# Altium schematic sheet SH6 - MICROCONTROLLER.SchDoc: Microcontroller
size B; CheckedBy: Lance Bantoto; DrawnBy: Kyle Hong; Engineer: Kyle Hong; Organization: UW Robotics; Address1: 200 University Avenue; Address2: Waterloo; Address3: Ontario; Address4: Canada N2L 3G6; Revision: 2; SheetNumber: 6; SheetTotal: 8
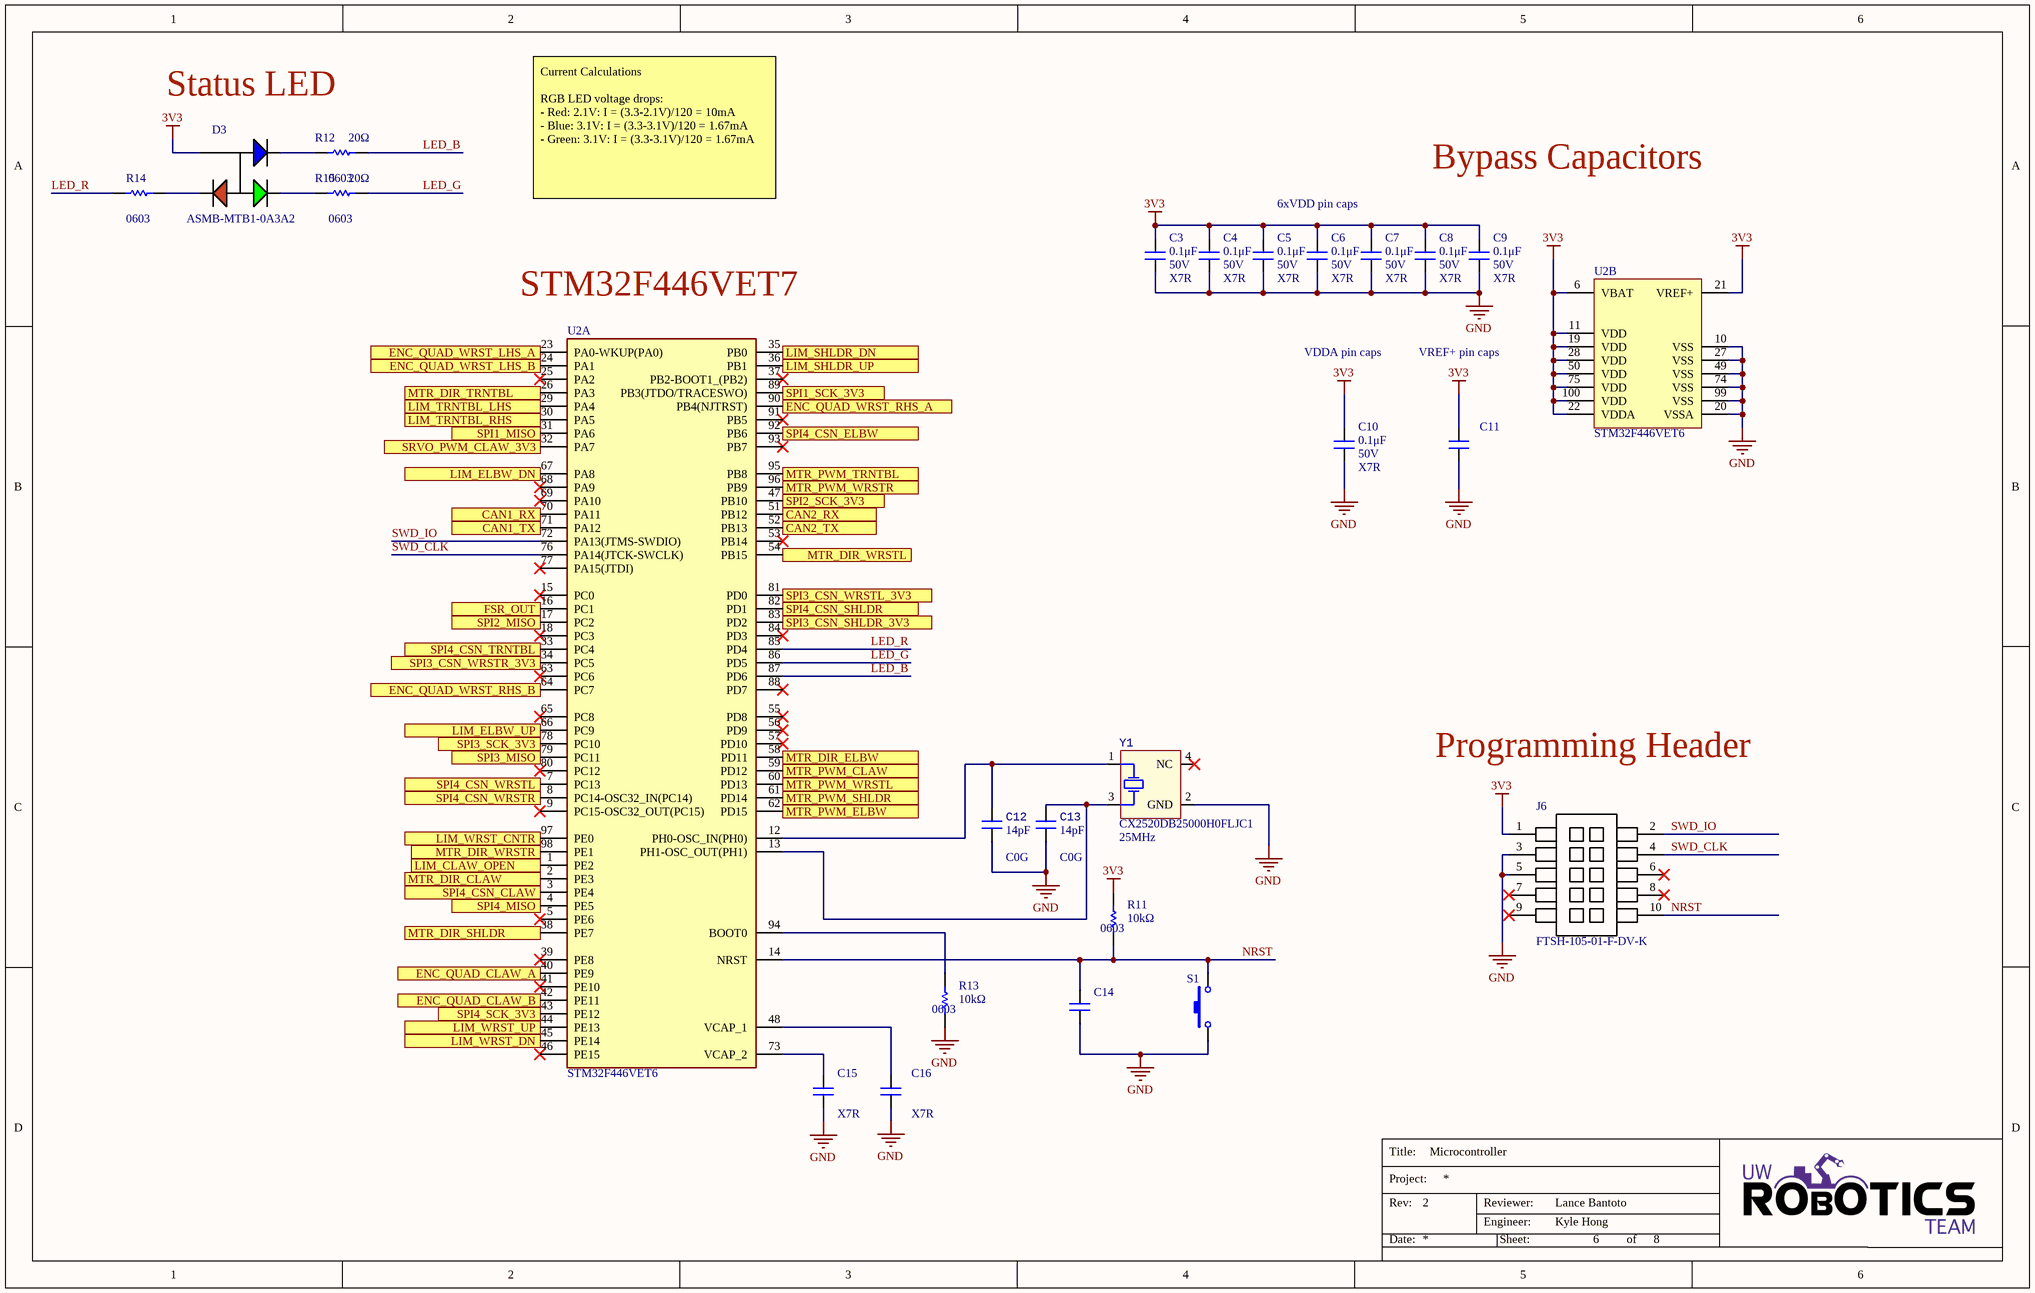
[diagram p0: SH6 - MICROCONTROLLER.SchDoc]

## Parts
C3  value 0.1μF  Voltage Rating: 50V  Dielectric: X7R  [CAP0603]  (hidden comment: CAP_0.1uF_50V_0603)
C4  value 0.1μF  Voltage Rating: 50V  Dielectric: X7R  [CAP0603]  (hidden comment: CAP_0.1uF_50V_0603)
C5  value 0.1μF  Voltage Rating: 50V  Dielectric: X7R  [CAP0603]  (hidden comment: CAP_0.1uF_50V_0603)
C6  value 0.1μF  Voltage Rating: 50V  Dielectric: X7R  [CAP0603]  (hidden comment: CAP_0.1uF_50V_0603)
C7  value 0.1μF  Voltage Rating: 50V  Dielectric: X7R  [CAP0603]  (hidden comment: CAP_0.1uF_50V_0603)
C8  value 0.1μF  Voltage Rating: 50V  Dielectric: X7R  [CAP0603]  (hidden comment: CAP_0.1uF_50V_0603)
C9  value 0.1μF  Voltage Rating: 50V  Dielectric: X7R  [CAP0603]  (hidden comment: CAP_0.1uF_50V_0603)
C10  value 0.1μF  Voltage Rating: 50V  Dielectric: X7R  [CAP0603]  (hidden comment: CAP_0.1uF_50V_0603)
C11  CAP_1uF_25V_0603  [CAP0603]  (value not drawn)
C12  value 14pF  Dielectric: C0G  [CAP0603]  (hidden comment: CAP_14pF_50V_0603)
C13  value 14pF  Dielectric: C0G  [CAP0603]  (hidden comment: CAP_14pF_50V_0603)
C14  CAP_1uF_25V_0603  [CAP0603]  (value not drawn)
C15  Dielectric: X7R  [CAP1206]  (hidden comment: CAP_4.7uF_50V_1206)
C16  Dielectric: X7R  [CAP1206]  (hidden comment: CAP_4.7uF_50V_1206)
D3  Manufacturer Part Number 1: ASMB-MTB1-0A3A2  [LED_RGB]  (hidden comment: LED_RGB)
J6  Manufacturer Part Number 1: FTSH-105-01-F-DV-K  [FTSH-105-01-F-DV-K-P-TR]  (hidden comment: CON_PROGRAMMING)
R11  value 10kΩ  Package/Footprint: 0603  [RESC0603]  (hidden comment: RES_10kΩ_0603_5%)
R12  value 20Ω  Package/Footprint: 0603  [RESC0603]  (hidden comment: RES_20Ω_0603_5%)
R13  value 10kΩ  Package/Footprint: 0603  [RESC0603]  (hidden comment: RES_10kΩ_0603_5%)
R14  Package/Footprint: 0603  [RESC0603]  (hidden comment: RES_120Ω_0603_5%_HP)
R15  value 20Ω  Package/Footprint: 0603  [RESC0603]  (hidden comment: RES_20Ω_0603_5%)
S1  SW_TACTILE  [B3U-1000P]  (value not drawn)
U2  STM32F446VET6  [STM32F446VET6]  (parts A,B of 2)
Y1  Manufacturer Part Number 1: CX2520DB25000H0FLJC1  Frequency: 25MHz  [SOIC254P1016X440-4N]  (hidden comment: CRYSTAL_25MHZ)

## Ports
CAN1_RX (out), CAN1_TX (in), CAN2_RX (out), CAN2_TX (in), ENC_QUAD_CLAW_A (in), ENC_QUAD_CLAW_B (in), ENC_QUAD_WRST_LHS_A (in), ENC_QUAD_WRST_LHS_B (in), ENC_QUAD_WRST_RHS_A (in), ENC_QUAD_WRST_RHS_B (in), FSR_OUT (in), LIM_CLAW_OPEN (in), LIM_ELBW_DN (in), LIM_ELBW_UP (in), LIM_SHLDR_DN (in), LIM_SHLDR_UP (in), LIM_TRNTBL_LHS (in), LIM_TRNTBL_RHS (in), LIM_WRST_CNTR (in), LIM_WRST_DN (in), LIM_WRST_UP (in), MTR_DIR_CLAW (out), MTR_DIR_ELBW (out), MTR_DIR_SHLDR (out), MTR_DIR_TRNTBL (out), MTR_DIR_WRSTL (out), MTR_DIR_WRSTR (out), MTR_PWM_CLAW (out), MTR_PWM_ELBW (out), MTR_PWM_SHLDR (out), MTR_PWM_TRNTBL (out), MTR_PWM_WRSTL (out), MTR_PWM_WRSTR (out), SPI1_MISO (in), SPI1_SCK_3V3 (out), SPI2_MISO (in), SPI2_SCK_3V3, SPI3_CSN_SHLDR_3V3 (out), SPI3_CSN_WRSTL_3V3 (out), SPI3_CSN_WRSTR_3V3 (out), SPI3_MISO (in), SPI3_SCK_3V3 (out), SPI4_CSN_CLAW (out), SPI4_CSN_ELBW (out), SPI4_CSN_SHLDR (out), SPI4_CSN_TRNTBL (out), SPI4_CSN_WRSTL (out), SPI4_CSN_WRSTR (out), SPI4_MISO (in), SPI4_SCK_3V3 (out), SRVO_PWM_CLAW_3V3 (out)

## Nets
3V3: C3.1 C4.1 C5.1 C6.1 C7.1 C8.1 C9.1 C10.2 C11.2 D3.4(COMMON_ANODE) J6.1 R11.1 U2.6(VBAT) U2.11(VDD) U2.19(VDD) U2.21(VREF+) U2.22(VDDA) U2.28(VDD) U2.50(VDD) U2.75(VDD) U2.100(VDD)
GND: C3.2 C4.2 C5.2 C6.2 C7.2 C8.2 C9.2 C10.1 C11.1 C12.1 C13.1 C14.1 C15.1 C16.1 J6.3 J6.5 R13.2 S1.1 U2.10(VSS) U2.20(VSSA) U2.27(VSS) U2.49(VSS) U2.74(VSS) U2.99(VSS) Y1.2(GND)
CAN1_RX: U2.70(PA11) ; port CAN1_RX
CAN1_TX: U2.71(PA12) ; port CAN1_TX
CAN2_RX: U2.51(PB12) ; port CAN2_RX
CAN2_TX: U2.52(PB13) ; port CAN2_TX
ENC_QUAD_CLAW_A: U2.40(PE9) ; port ENC_QUAD_CLAW_A
ENC_QUAD_CLAW_B: U2.42(PE11) ; port ENC_QUAD_CLAW_B
ENC_QUAD_WRST_LHS_A: U2.23(PA0-WKUP(PA0)) ; port ENC_QUAD_WRST_LHS_A
ENC_QUAD_WRST_LHS_B: U2.24(PA1) ; port ENC_QUAD_WRST_LHS_B
ENC_QUAD_WRST_RHS_A: U2.90(PB4(NJTRST)) ; port ENC_QUAD_WRST_RHS_A
ENC_QUAD_WRST_RHS_B: U2.64(PC7) ; port ENC_QUAD_WRST_RHS_B
FSR_OUT: U2.16(PC1) ; port FSR_OUT
LED_B: R12.2 U2.87(PD6)
LED_G: R15.2 U2.86(PD5)
LED_R: R14.1 U2.85(PD4)
LIM_CLAW_OPEN: U2.1(PE2) ; port LIM_CLAW_OPEN
LIM_ELBW_DN: U2.67(PA8) ; port LIM_ELBW_DN
LIM_ELBW_UP: U2.66(PC9) ; port LIM_ELBW_UP
LIM_SHLDR_DN: U2.35(PB0) ; port LIM_SHLDR_DN
LIM_SHLDR_UP: U2.36(PB1) ; port LIM_SHLDR_UP
LIM_TRNTBL_LHS: U2.29(PA4) ; port LIM_TRNTBL_LHS
LIM_TRNTBL_RHS: U2.30(PA5) ; port LIM_TRNTBL_RHS
LIM_WRST_CNTR: U2.97(PE0) ; port LIM_WRST_CNTR
LIM_WRST_DN: U2.45(PE14) ; port LIM_WRST_DN
LIM_WRST_UP: U2.44(PE13) ; port LIM_WRST_UP
MTR_DIR_CLAW: U2.2(PE3) ; port MTR_DIR_CLAW
MTR_DIR_ELBW: U2.58(PD11) ; port MTR_DIR_ELBW
MTR_DIR_SHLDR: U2.38(PE7) ; port MTR_DIR_SHLDR
MTR_DIR_TRNTBL: U2.26(PA3) ; port MTR_DIR_TRNTBL
MTR_DIR_WRSTL: U2.54(PB15) ; port MTR_DIR_WRSTL
MTR_DIR_WRSTR: U2.98(PE1) ; port MTR_DIR_WRSTR
MTR_PWM_CLAW: U2.59(PD12) ; port MTR_PWM_CLAW
MTR_PWM_ELBW: U2.62(PD15) ; port MTR_PWM_ELBW
MTR_PWM_SHLDR: U2.61(PD14) ; port MTR_PWM_SHLDR
MTR_PWM_TRNTBL: U2.95(PB8) ; port MTR_PWM_TRNTBL
MTR_PWM_WRSTL: U2.60(PD13) ; port MTR_PWM_WRSTL
MTR_PWM_WRSTR: U2.96(PB9) ; port MTR_PWM_WRSTR
NRST: C14.2 J6.10 R11.2 S1.2 U2.14(NRST)
SPI1_MISO: U2.31(PA6) ; port SPI1_MISO
SPI1_SCK_3V3: U2.89(PB3(JTDO/TRACESWO)) ; port SPI1_SCK_3V3
SPI2_MISO: U2.17(PC2) ; port SPI2_MISO
SPI2_SCK_3V3: U2.47(PB10) ; port SPI2_SCK_3V3
SPI3_CSN_SHLDR_3V3: U2.83(PD2) ; port SPI3_CSN_SHLDR_3V3
SPI3_CSN_WRSTL_3V3: U2.81(PD0) ; port SPI3_CSN_WRSTL_3V3
SPI3_CSN_WRSTR_3V3: U2.34(PC5) ; port SPI3_CSN_WRSTR_3V3
SPI3_MISO: U2.79(PC11) ; port SPI3_MISO
SPI3_SCK_3V3: U2.78(PC10) ; port SPI3_SCK_3V3
SPI4_CSN_CLAW: U2.3(PE4) ; port SPI4_CSN_CLAW
SPI4_CSN_ELBW: U2.92(PB6) ; port SPI4_CSN_ELBW
SPI4_CSN_SHLDR: U2.82(PD1) ; port SPI4_CSN_SHLDR
SPI4_CSN_TRNTBL: U2.33(PC4) ; port SPI4_CSN_TRNTBL
SPI4_CSN_WRSTL: U2.7(PC13) ; port SPI4_CSN_WRSTL
SPI4_CSN_WRSTR: U2.8(PC14-OSC32_IN(PC14)) ; port SPI4_CSN_WRSTR
SPI4_MISO: U2.4(PE5) ; port SPI4_MISO
SPI4_SCK_3V3: U2.43(PE12) ; port SPI4_SCK_3V3
SRVO_PWM_CLAW_3V3: U2.32(PA7) ; port SRVO_PWM_CLAW_3V3
SWD_CLK: J6.4 U2.76(PA14(JTCK-SWCLK))
SWD_IO: J6.2 U2.72(PA13(JTMS-SWDIO))
NetC12_2: C12.2 U2.12(PH0-OSC_IN(PH0)) Y1.1(HOT)
NetC13_2: C13.2 U2.13(PH1-OSC_OUT(PH1)) Y1.3(HOT)
NetC15_2: C15.2 U2.73(VCAP_2)
NetC16_2: C16.2 U2.48(VCAP_1)
NetD3_1: D3.1(CATHODE_(RED)) R14.2
NetD3_2: D3.2(CATHODE_(GREEN)) R15.1
NetD3_3: D3.3(CATHODE_(BLUE)) R12.1
NetR13_1: R13.1 U2.94(BOOT0)

Not connected (* = marked no-connect by the designer): J6 6* 7* 8* 9*; U2 5(PE6)* 9(PC15-OSC32_OUT(PC15))* 15(PC0)* 18(PC3)* 25(PA2)* 37(PB2-BOOT1_(PB2))* 39(PE8)* 41(PE10)* 46(PE15)* 53(PB14)* 55(PD8)* 56(PD9)* 57(PD10)* 63(PC6)* 65(PC8)* 68(PA9)* 69(PA10)* 77(PA15(JTDI))* 80(PC12)* 84(PD3)* 88(PD7)* 91(PB5)* 93(PB7)*; Y1 4(NC)*

## Notes on the sheet
- Status LED
- Current Calculations
  RGB LED voltage drops:
  - Red: 2.1V: I = (3.3-2.1V)/120 = 10mA
  - Blue: 3.1V: I = (3.3-3.1V)/120 = 1.67mA
  - Green: 3.1V: I = (3.3-3.1V)/120 = 1.67mA
- 6xVDD pin caps
- Bypass Capacitors
- (near U2) STM32F446VET7
- VDDA pin caps
- VREF+ pin caps
- Programming Header
- Title:
- Project:
- Date:
- Rev:
- Reviewer:
- Engineer:
- Sheet:
- of

## Library data of the parts
C3-C10 = CAP_0.1uF_50V_0603: CAP CER 0.1UF 50V X7R 0603; Manufacturer Part Number 1: CC0603KRX7R9BB104; Manufacturer 1: Yageo; Package/Footprint: 0603; Supplier Part Number 1: 311-1344-1-ND; Supplier 1: Digi-Key; Mounting Type: SMD
C11 = CAP_1uF_25V_0603: CAP CER 1UF 25V X5R 0603; Manufacturer 1: Samsung; Manufacturer Part Number 1: CL10A105KA8NNNC; Package/Footprint: 0603; Supplier Part Number 1: 1276-1102-1-ND; Supplier 1: Digi-Key; Mounting Type: SMD
C12 C13 = CAP_14pF_50V_0603: CAP CER 14PF 50V C0G/NP0 0603; Manufacturer 1: Samsung; Manufacturer Part Number 1: CL10C140JB8NNNC; Package/Footprint: 0603; Supplier 1: Digi-Key; Voltage Rating: 50V; Supplier Part Number 1: 1276-2187-1-ND; Mounting Type: SMD
C14 = CAP_1uF_25V_0603: CAP CER 1UF 25V X5R 0603; Manufacturer Part Number 1: CL10A105KA8NNNC; Manufacturer 1: Samsung; Package/Footprint: 0603; Supplier Part Number 1: 1276-1102-1-ND; Supplier 1: Digi-Key; Mounting Type: SMD
C15 C16 = CAP_4.7uF_50V_1206: CAP CER 4.7UF 50V X7R 1206; Manufacturer Part Number 1: GRM31CR71H475KA12L; Manufacturer 1: Murata; Package/Footprint: 1206; Supplier Part Number 1: 490-6521-1-ND; Supplier 1: Digi-Key; Mounting Type: SMD
D3 = LED_RGB: LED RGB DIFFUSED 4PLCC SMD; Manufacturer 1: Broadcom; Color: Blue,Green,Red; Lens Color: White; Viewing Angle: 115°; Lens Style: Round; Luminous Intensity: 350mcd; Dominant Wavelength: 470nm; Forward Voltage: 3.1V; Test Current: 20mA; Package/Footprint: 4-PLCC; Supplier 1: Digi-Key; Number of Pins: 4; Lens Transparency: Diffused; Supplier Part Number 1: 516-3280-1-ND; Mounting Type: SMD
J6 = CON_PROGRAMMING: CONN HEADER SMD 10POS 1.27MM; Manufacturer 1: Samtec; Supplier 1: Digi-Key; Pitch: 1.27mm; Supplier Part Number 1: SAM8796-ND; Mounting Type: SMD; Package/Footprint: SMD
R11 R13 = RES_10kΩ_0603_5%: RES 10K OHM 5% 1/10W 0603; Manufacturer 1: Yageo; Manufacturer Part Number 1: RC0603JR-0710KL; Supplier Part Number 1: 311-10KGRCT-ND; Supplier 1: Digi-Key; Mounting Type: SMD
R12 R15 = RES_20Ω_0603_5%: RES 20 OHM 5% 1/10W 0603; Manufacturer 1: Yageo; Manufacturer Part Number 1: RC0603JR-0720RL; Supplier Part Number 1: 311-20GRCT-ND; Supplier 1: Digi-Key; Mounting Type: SMD
R14 = RES_120Ω_0603_5%_HP: RES 120 OHM 5% 1/4W 0603; Manufacturer 1: Rohm; Manufacturer Part Number 1: ESR03EZPJ121; Supplier Part Number 1: RHM120DCT-ND; Supplier 1: Digi-Key; Mounting Type: SMD
S1 = SW_TACTILE: SWITCH TACTILE SPST-NO 0.05A 12V; Manufacturer 1: Omron Electronics Inc-EMC Div; Package/Footprint: SMD; Supplier Part Number 1: SW1020CT-ND; Supplier 1: Digi-Key; Manufacturer Part Number 1: B3U-1000P; Mounting Type: SMD
U2 = STM32F446VET6: IC MCU 32BIT 512KB FLASH 100LQFP; Manufacturer 1: STMicroelectronics; Manufacturer Part Number 1: STM32F446VET6TR; Power Supplies: 1.8/3.3V; Speed: 180RPM; Max Supply Current: 115mA; Qualification Status: Not Qualified; Package/Footprint: 100-LQFP; Supplier 1: Digi-Key; Package Code: QFP; Number of Pins: 100; Surface Mount: Yes; Terminal Pitch: 0.5mm; Supplier Part Number 1: 497-19359-1-ND; Mounting Type: SMD
Y1 = CRYSTAL_25MHZ: CRYSTAL 25.0000MHZ 12PF SMD; Manufacturer 1: Kyocera AVX; Supplier 1: Digi-Key; Supplier Part Number 1: 1253-1724-1-ND; Load Capacitance: 12pF; Mounting Type: SMD; Package/Footprint: SMD